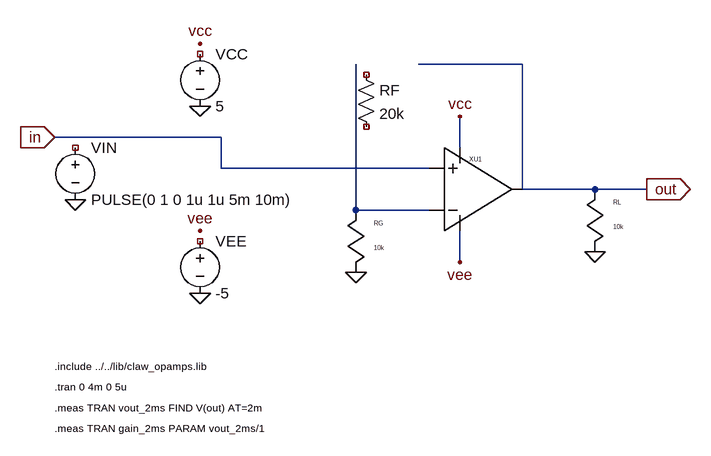
[diagram p0: schematic opamp_noninverting.asc]
opamp_noninverting.asc, the LTspice schematic file:
Version 4
SHEET 1 1200 823
WIRE 64 192 320 192
WIRE 320 192 320 240
WIRE 320 240 640 240
WIRE 784 272 976 272
WIRE 528 304 640 304
WIRE 528 304 528 80
WIRE 624 80 784 80
WIRE 784 80 784 272
WIRE 688 208 688 160
WIRE 688 336 688 384
SYMBOL voltage 96 192 R0
SYMATTR InstName VIN
SYMATTR Value PULSE(0 1 0 1u 1u 5m 10m)
SYMBOL voltage 288 48 R0
SYMATTR InstName VCC
SYMATTR Value 5
SYMBOL voltage 288 336 R0
SYMATTR InstName VEE
SYMATTR Value -5
SYMBOL opamp2 640 208 R0
SYMATTR InstName XU1
SYMATTR Value CLAW_IDEAL_OPAMP
SYMBOL res_v 528 304 R0
SYMATTR InstName RG
SYMATTR Value 10k
SYMBOL res 528 80 R0
SYMATTR InstName RF
SYMATTR Value 20k
SYMBOL res_v 896 272 R0
SYMATTR InstName RL
SYMATTR Value 10k
FLAG 64 192 in
IOPIN 64 192 In
FLAG 976 272 out
IOPIN 976 272 Out
FLAG 96 288 0
FLAG 528 400 0
FLAG 896 368 0
FLAG 288 48 vcc
FLAG 288 144 0
FLAG 288 336 vee
FLAG 288 432 0
FLAG 688 160 vcc
FLAG 688 384 vee
TEXT 64 544 Left 1 !.include ../../lib/claw_opamps.lib
TEXT 64 576 Left 1 !.tran 0 4m 0 5u
TEXT 64 608 Left 1 !.meas TRAN vout_2ms FIND V(out) AT=2m
TEXT 64 640 Left 1 !.meas TRAN gain_2ms PARAM vout_2ms/1

The netlist it stands for:
* opamp_noninverting.asc
VIN NC_01 0 PULSE(0 1 0 1u 1u 5m 10m)
VCC NC_02 0 5
VEE NC_03 0 -5
XXU1 CLAW_IDEAL_OPAMP CLAW_IDEAL_OPAMP
RG N001 0 10k
RF NC_04 NC_05 20k
RL out 0 10k
.include ../../lib/claw_opamps.lib
.tran 0 4m 0 5u
.meas TRAN vout_2ms FIND V(out) AT=2m
.meas TRAN gain_2ms PARAM vout_2ms/1
.backanno
.end